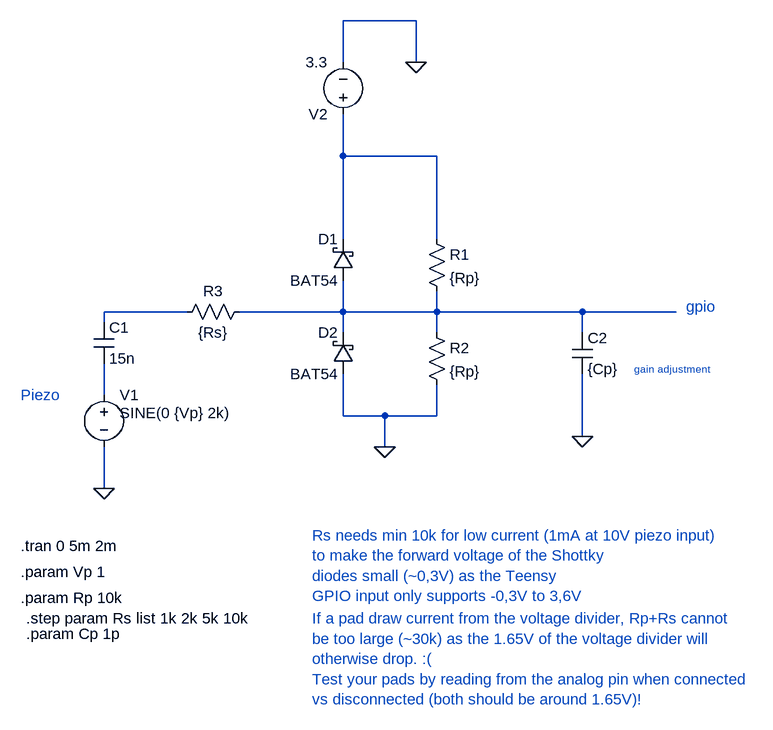
[diagram p0: schematic edrumulus.asc]
edrumulus.asc, the LTspice schematic file:
Version 4
SHEET 1 1420 712
WIRE 288 -336 176 -336
WIRE 176 -272 176 -336
WIRE 288 -272 288 -336
WIRE 176 -128 176 -192
WIRE 320 -128 176 -128
WIRE 176 0 176 -128
WIRE 320 0 320 -128
WIRE -64 112 -192 112
WIRE 176 112 176 64
WIRE 176 112 16 112
WIRE 320 112 320 80
WIRE 320 112 176 112
WIRE 544 112 320 112
WIRE 688 112 544 112
WIRE -192 128 -192 112
WIRE 176 144 176 112
WIRE 320 144 320 112
WIRE 544 144 544 112
WIRE -192 240 -192 192
WIRE 176 272 176 208
WIRE 240 272 176 272
WIRE 320 272 320 224
WIRE 320 272 240 272
WIRE 544 304 544 208
WIRE 240 320 240 272
WIRE -192 384 -192 320
FLAG -192 384 0
FLAG 288 -272 0
FLAG 240 320 0
FLAG 544 304 0
SYMBOL voltage -192 224 R0
WINDOW 123 0 0 Left 0
WINDOW 39 24 124 Left 2
WINDOW 3 24 44 Left 2
SYMATTR Value SINE(0 {Vp} 2k)
SYMATTR InstName V1
SYMBOL cap -208 128 R0
SYMATTR InstName C1
SYMATTR Value 15n
SYMBOL schottky 192 64 R180
WINDOW 0 24 64 Left 2
WINDOW 3 24 0 Left 2
SYMATTR InstName D1
SYMATTR Value BAT54
SYMATTR Description Diode
SYMATTR Type diode
SYMBOL schottky 192 208 R180
WINDOW 0 24 64 Left 2
WINDOW 3 24 0 Left 2
SYMATTR InstName D2
SYMATTR Value BAT54
SYMATTR Description Diode
SYMATTR Type diode
SYMBOL res 304 -16 R0
SYMATTR InstName R1
SYMATTR Value {Rp}
SYMBOL res 304 128 R0
SYMATTR InstName R2
SYMATTR Value {Rp}
SYMBOL voltage 176 -176 R180
WINDOW 123 0 0 Left 0
WINDOW 39 0 0 Left 0
SYMATTR InstName V2
SYMATTR Value 3.3
SYMBOL res 32 96 R90
WINDOW 0 0 56 VBottom 2
WINDOW 3 32 56 VTop 2
SYMATTR InstName R3
SYMATTR Value {Rs}
SYMBOL cap 528 144 R0
SYMATTR InstName C2
SYMATTR Value {Cp}
TEXT -320 240 Left 2 ;Piezo
TEXT 704 104 Left 2 ;gpio
TEXT 624 200 Left 1 ;gain adjustment
TEXT -320 472 Left 2 !.tran 0 5m 2m
TEXT -320 552 Left 2 !.param Rp 10k
TEXT -312 608 Left 2 !.param Cp 1p
TEXT -320 512 Left 2 !.param Vp 1
TEXT -312 584 Left 2 !.step param Rs list 1k 2k 5k 10k
TEXT 128 456 Left 2 ;Rs needs min 10k for low current (1mA at 10V piezo input)\nto make the forward voltage of the Shottky\ndiodes small (~0,3V) as the Teensy\nGPIO input only supports -0,3V to 3,6V
TEXT 128 584 Left 2 ;If a pad draw current from the voltage divider, Rp+Rs cannot\nbe too large (~30k) as the 1.65V of the voltage divider will\notherwise drop. :(\nTest your pads by reading from the analog pin when connected\nvs disconnected (both should be around 1.65V)!

The netlist it stands for:
* edrumulus.asc
V1 N004 0 SINE(0 {Vp} 2k)
C1 N002 N004 15n
D1 N003 N001 BAT54
D2 0 N003 BAT54
R1 N001 N003 {Rp}
R2 N003 0 {Rp}
V2 N001 0 3.3
R3 N003 N002 {Rs}
C2 N003 0 {Cp}
.model D D
.lib standard.dio
* Piezo
* gpio
* gain adjustment
.tran 0 5m 2m
.param Rp 10k
.param Cp 1p
.param Vp 1
.step param Rs list 1k 2k 5k 10k
* Rs needs min 10k for low current (1mA at 10V piezo input)
* to make the forward voltage of the Shottky
* diodes small (~0,3V) as the Teensy
* GPIO input only supports -0,3V to 3,6V
* If a pad draw current from the voltage divider, Rp+Rs cannot
* be too large (~30k) as the 1.65V of the voltage divider will
* otherwise drop. :(
* Test your pads by reading from the analog pin when connected
* vs disconnected (both should be around 1.65V)!
.backanno
.end